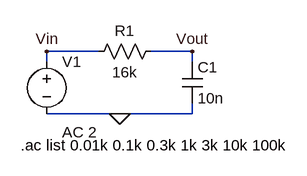
[diagram p0: schematic Low pass filter.asc]
Low pass filter.asc, the LTspice schematic file:
Version 4
SHEET 1 880 680
WIRE 208 96 128 96
WIRE 352 96 288 96
WIRE 128 112 128 96
WIRE 352 112 352 96
WIRE 240 192 128 192
WIRE 352 192 352 176
WIRE 352 192 240 192
FLAG 240 192 0
FLAG 352 96 Vout
FLAG 128 96 Vin
SYMBOL voltage 128 96 R0
WINDOW 123 24 124 Left 2
WINDOW 39 0 0 Left 0
SYMATTR Value2 AC 2
SYMATTR InstName V1
SYMATTR Value ""
SYMBOL res 304 80 R90
WINDOW 0 0 56 VBottom 2
WINDOW 3 32 56 VTop 2
SYMATTR InstName R1
SYMATTR Value 16k
SYMBOL cap 336 112 R0
SYMATTR InstName C1
SYMATTR Value 10n
TEXT 88 240 Left 2 !.ac list 0.01k 0.1k 0.3k 1k 3k 10k 100k

The netlist it stands for:
* Low pass filter.asc
V1 Vin 0 AC 2
R1 Vout Vin 16k
C1 Vout 0 10n
.ac list 0.01k 0.1k 0.3k 1k 3k 10k 100k
.backanno
.end